# Altium schematic sheet STCLock.SchDoc
size A4
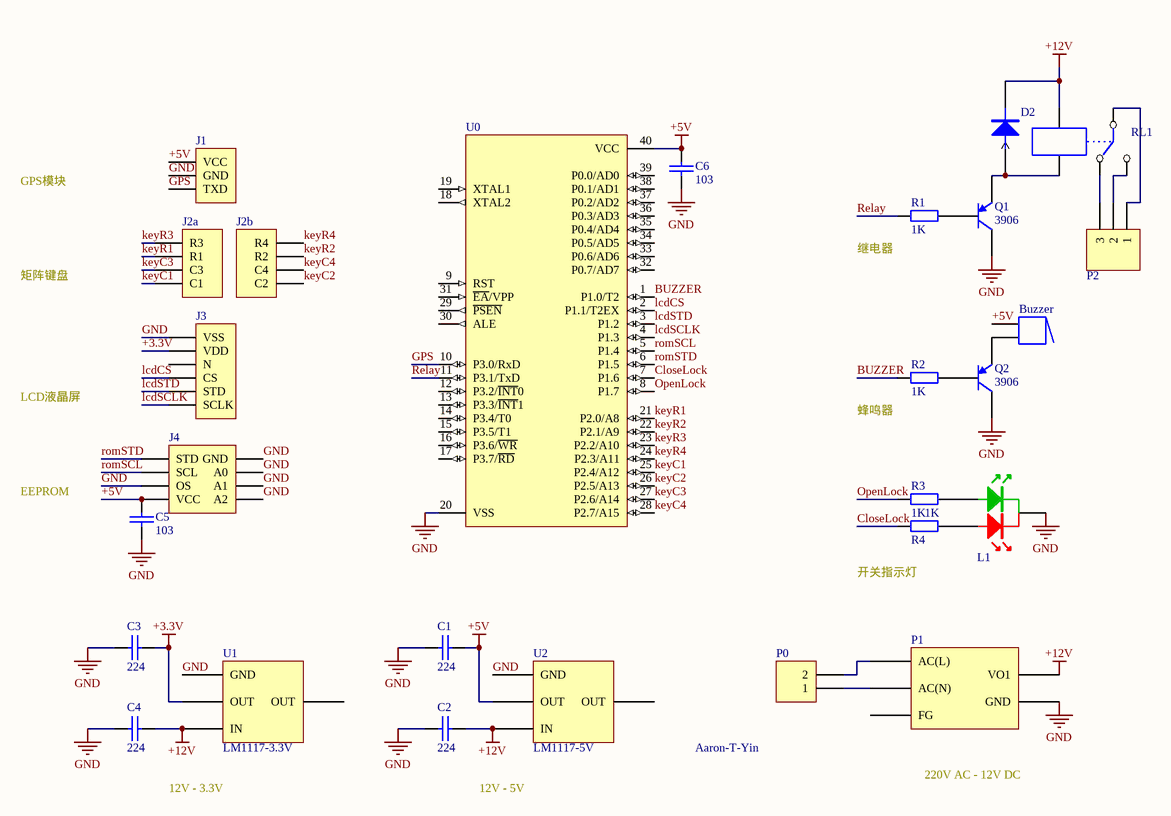
[diagram p0: STCLock.SchDoc]

## Parts
*  AaronTYin  (value not drawn)
Buzzer  Buzzer  [BUZ8/12]  (value not drawn)
C1  224  [0805]
C2  224  [0805]
C3  224  [0805]
C4  224  [0805]
C5  103  [0805]
C6  103  [0805]
D2  DIODE  [5819]  (value not drawn)
J1  GPS  [HDR1X3]  (value not drawn)
J2a  Header 4  [HDR1X4]  (value not drawn)
J2b  Header 4  [HDR1X4]  (value not drawn)
J3  LCD12864  [HDR1X6]  (value not drawn)
J4  AT24C02  [DIP8]  (value not drawn)
L1  LED_3_K  [HDR1X3]  (value not drawn)
P0  Header 2  [DG46G_2]  (value not drawn)
P1  LAP5-220SXX  [LAP5-220SXX]  (value not drawn)
P2  Header 3  [111]  (value not drawn)
Q1  3906  [SOT-23-et]
Q2  3906  [SOT-23-et]
R1  value 1K  [0805]  (hidden comment: Res Semi)
R2  value 1K  [0805]  (hidden comment: Res Semi)
R3  value 1K  [0805]  (hidden comment: Res2)
R4  value 1K  [0805]  (hidden comment: Res2)
RL1  G2R-1  [G2R-1]  (value not drawn)
U0  STC89C52RC  [SOT129-1]  (value not drawn)
U1  LM1117-3.3V  [AMS1117]
U2  LM1117-5V  [AMS1117]

## Nets
+3.3V: C3.2 J3.2(VDD) U1.2(OUT)
+5V: Buzzer.1 C1.2 C5.1 C6.1 J1.1(VCC) J4.4(VCC) U0.40(VCC) U2.2(OUT)
+12V: C2.2 C4.2 D2.2 P1.4(VO1) RL1.5 U1.3(IN) U2.3(IN)
GND: C1.1 C2.1 C3.1 C4.1 C5.2 C6.2 J1.2(GND) J3.1(VSS) J4.3(OS) J4.5(A2) J4.6(A1) J4.7(A0) J4.8(GND) L1.1 P1.5(GND) Q1.3(C) Q2.3(C) U0.20(VSS) U1.1(GND) U2.1(GND)
BUZZER: R2.1 U0.1(P1.0/T2)
CloseLock: R4.1 U0.7(P1.6)
GPS: J1.3(TXD) U0.10(P3.0/RxD)
keyC1: J2a.4(C1) U0.25(P2.4/A12)
keyC2: J2b.1(C2) U0.26(P2.5/A13)
keyC3: J2a.3(C3) U0.27(P2.6/A14)
keyC4: J2b.2(C4) U0.28(P2.7/A15)
keyR1: J2a.2(R1) U0.21(P2.0/A8)
keyR2: J2b.3(R2) U0.22(P2.1/A9)
keyR3: J2a.1(R3) U0.23(P2.2/A10)
keyR4: J2b.4(R4) U0.24(P2.3/A11)
lcdCS: J3.4(CS) U0.2(P1.1/T2EX)
lcdSCLK: J3.6(SCLK) U0.4(P1.3)
lcdSTD: J3.5(STD) U0.3(P1.2)
OpenLock: R3.1 U0.8(P1.7)
Relay: R1.1 U0.11(P3.1/TxD)
romSCL: J4.2(SCL) U0.5(P1.4)
romSTD: J4.1(STD) U0.6(P1.5)
NetBuzzer_2: Buzzer.2 Q2.1(E)
NetD2_1: D2.1 Q1.1(E) RL1.1
NetL1_2: L1.2 R4.2
NetL1_3: L1.3 R3.2
NetP0_1: P0.1 P1.2(AC(N))
NetP0_2: P0.2 P1.3(AC(L))
NetP2_1: P2.1 RL1.4
NetP2_2: P2.2 RL1.3
NetP2_3: P2.3 RL1.2
NetQ1_2: Q1.2(B) R1.2
NetQ2_2: Q2.2(B) R2.2

Not connected (* = marked no-connect by the designer): J3 3(N); P1 1(FG); U0 9(RST) 12(P3.2/~{INT}0) 13(P3.3/~{INT}1) 14(P3.4/T0) 15(P3.5/T1) 16(P3.6/~{WR}) 17(P3.7/~{RD}) 18(XTAL2) 19(XTAL1) 29(~{PSEN}) 30(ALE) 31(~{EA}/VPP) 32(P0.7/AD7) 33(P0.6/AD6) 34(P0.5/AD5) 35(P0.4/AD4) 36(P0.3/AD3) 37(P0.2/AD2) 38(P0.1/AD1) 39(P0.0/AD0); U1 4(OUT); U2 4(OUT)

## Notes on the sheet
- GPS模块
- 矩阵键盘
- (near R1) 继电器
- LCD液晶屏
- (near R2) 蜂鸣器
- EEPROM
- 开关指示灯
- 12V - 3.3V
- 12V - 5V
- 220V AC - 12V DC
- (in symbol AaronTYin) Aaron-T-Yin

## Library data of the parts
Buzzer = Buzzer: Magnetic Transducer Buzzer; Revision 1: Jul-2002: Re-released for DXP Platform.; Revision 2: 17-Dec-2003: Schematic revised, PCB Footprint replaced.; Published: 17-Dec-2003; Datasheet: Latest Revision: 17-Dec-2003; Publisher: Altium Limited
C1-C6 = CAP: Capacitor
J1 P2 = Header 3: Header, 3-Pin; Publisher: Altium Limited
  J1: Revision: 17-Jul-2002: Re-released for DXP Platform.
  P2: LatestRevisionDate: 17-Jul-2002; LatestRevisionNote: Re-released for DXP Platform.
J2a J2b = Header 4: Header, 4-Pin; LatestRevisionDate: 17-Jul-2002; LatestRevisionNote: Re-released for DXP Platform.; Publisher: Altium Limited
J3 = Header 6: Header, 6-Pin; Revision: 17-Jul-2002: Re-released for DXP Platform.; Publisher: Altium Limited
J4 = LM75A
P0 = Header 2: Header, 2-Pin; LatestRevisionDate: 17-Jul-2002; LatestRevisionNote: Re-released for DXP Platform.; Publisher: Altium Limited
P1 = LAP5-220SXX: pin to pad: 5>8
Q1 Q2 = 2N3906: PNP General Purpose Amplifier; Revision 1: 11-Jul-2000: SIM Model Added.; Revision 2: 17-Jul-2002: Re-released for DXP Platform.; Revision 3: 15-Jan-2003: PCB Footprint 'BCY-W3/D4.7' replaced; Code - JEDEC: TO-92A; Published: 8-Jun-2000; Datasheet: Latest Revision: 1997; Package Reference: TO-92A; Publisher: Altium Limited
R1 R2 = Res Semi: Semiconductor Resistor; Published: 8-Jun-2000; Revision: July-2002: Re-released for DXP Platform.; Publisher: Altium Limited
R3 R4 = Res2: Resistor; Published: 8-Jun-2000; LatestRevisionDate: 17-Jul-2002; LatestRevisionNote: Re-released for DXP Platform.; PackageReference: AXIAL-0.4; Publisher: Altium Limited
U0 = P89C51X2BN: 80C51 8-Bit Flash Microcontroller Family, 4 kB Flash; Package Information: Latest Revision: Aug-2000; Code - JEDEC: MO-015; Published: 21-May-2003; Datasheet: Latest Revision: 5-Jun-2002; Package Reference: SOT129-1; Publisher: Altium Limited
U1 U2 = LM1117